# Altium schematic sheet WLAN_BLUETOOTH.SchDoc: WLAN_BLUETOOTH
size A4; Date: 21-MAR-2018; Author: A.B; CompanyName: STMicroelectronics; Organization: MCD/TOOLS/GNB; Address1: 12, Rue Jules HOROWITZ; Address2: 38019 Grenoble; Address3: FRANCE; DocumentNumber: MB1605; Revision: B-01; SheetNumber: 12; SheetTotal: 18; Project: STM32MP257
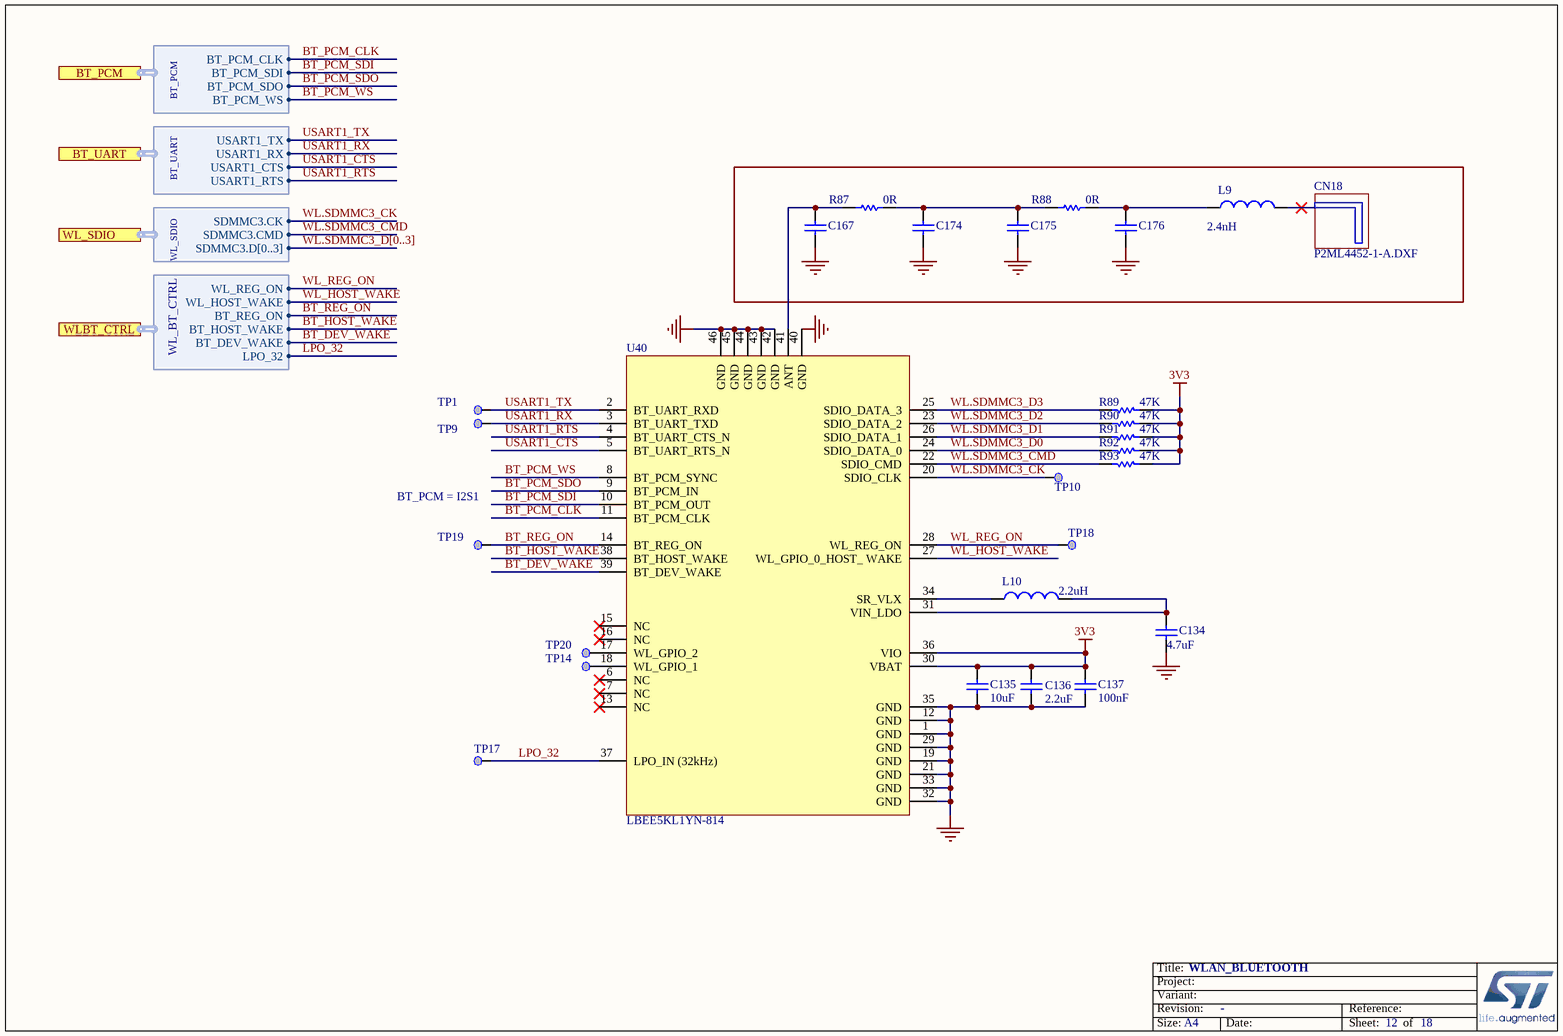
[diagram p0: WLAN_BLUETOOTH.SchDoc]

## Parts
C134  value 4.7uF  [C0402]  (hidden comment: Capacitor)
C135  value 10uF  [C0603]  (hidden comment: Capacitor)
C136  value 2.2uF  [C0603]  (hidden comment: Capacitor)
C137  value 100nF  [C0402]
C167  Capacitor  [C0402]  (value not drawn)
C174  Capacitor  [C0402]  (value not drawn)
C175  Capacitor  [C0402]  (value not drawn)
C176  Capacitor  [C0402]  (value not drawn)
CN18  value P2ML4452-1-A.DXF  [ANT_MURATA_TYPE-1-DX_P2ML4452-1-A_DXF]  (hidden comment: antenna_Wifi_BLE_Murata)  (no BOM)
L9  value 2.4nH  [IND_0402_MURATA_LQW15AN2N4C00X]  (hidden comment: Inductor)
L10  value 2.2uH  [L0603]  (hidden comment: Inductor)
R87  value 0R  [R0402]  (hidden comment: Resistor)
R88  value 0R  [R0402]  (hidden comment: Resistor)
R89  value 47K  [R0402]  (hidden comment: Resistor)
R90  value 47K  [R0402]  (hidden comment: Resistor)
R91  value 47K  [R0402]  (hidden comment: Resistor)
R92  value 47K  [R0402]  (hidden comment: Resistor)
R93  value 47K  [R0402]  (hidden comment: Resistor)
TP1  Test Point  [TP_SMD_0-6MM]  (value not drawn)  (no BOM)
TP9  Test Point  [TP_SMD_0-6MM]  (value not drawn)  (no BOM)
TP10  Test Point  [TP_SMD_0-6MM]  (value not drawn)  (no BOM)
TP14  Test Point  [TP_SMD_0-6MM]  (value not drawn)  (no BOM)
TP17  Test Point  [TP_SMD_0-6MM]  (value not drawn)  (no BOM)
TP18  Test Point  [TP_SMD_0-6MM]  (value not drawn)  (no BOM)
TP19  Test Point  [TP_SMD_0-6MM]  (value not drawn)  (no BOM)
TP20  Test Point  [TP_SMD_0-6MM]  (value not drawn)  (no BOM)
U40  LBEE5KL1YN-814  [MOD_WLAN-BT_MURATA_LBEE5KL1YN-814]

## Ports
BT_PCM (harness BT_PCM), BT_UART (harness BT_UART), WL_SDIO (harness WL_SDIO), WLBT_CTRL (harness WL_BT_CTRL)

## Harnesses
BT_PCM: BT_PCM_CLK, BT_PCM_SDI, BT_PCM_SDO, BT_PCM_WS
BT_UART: USART1_TX, USART1_RX, USART1_CTS, USART1_RTS
WL_SDIO: SDMMC3.CMD, SDMMC3.CK, SDMMC3.D[0..3]
WL_BT_CTRL: WL_REG_ON, WL_HOST_WAKE, BT_REG_ON, BT_HOST_WAKE, BT_DEV_WAKE, LPO_32

## Nets
3V3: C135.2 C136.2 C137.2 R89.1 R90.1 R91.1 R92.1 R93.1 U40.30(VBAT) U40.36(VIO)
GND: C134.1 C135.1 C136.1 C137.1 C167.1 C174.1 C175.1 C176.1 U40.1(GND) U40.12(GND) U40.19(GND) U40.21(GND) U40.29(GND) U40.32(GND) U40.33(GND) U40.35(GND) U40.40(GND) U40.42(GND) U40.43(GND) U40.44(GND) U40.45(GND) U40.46(GND)
BT_DEV_WAKE: U40.39(BT_DEV_WAKE) ; port WLBT_CTRL.BT_DEV_WAKE
BT_HOST_WAKE: U40.38(BT_HOST_WAKE) ; port WLBT_CTRL.BT_HOST_WAKE
BT_PCM_CLK: U40.11(BT_PCM_CLK) ; port BT_PCM.BT_PCM_CLK
BT_PCM_SDI: U40.10(BT_PCM_OUT) ; port BT_PCM.BT_PCM_SDI
BT_PCM_SDO: U40.9(BT_PCM_IN) ; port BT_PCM.BT_PCM_SDO
BT_PCM_WS: U40.8(BT_PCM_SYNC) ; port BT_PCM.BT_PCM_WS
BT_REG_ON: TP19.1 U40.14(BT_REG_ON) ; port WLBT_CTRL.BT_REG_ON
LPO_32: TP17.1 U40.37(LPO_IN_(32kHz)) ; port WLBT_CTRL.LPO_32
USART1_CTS: U40.5(BT_UART_RTS_N) ; port BT_UART.USART1_CTS
USART1_RTS: U40.4(BT_UART_CTS_N) ; port BT_UART.USART1_RTS
USART1_RX: TP9.1 U40.3(BT_UART_TXD) ; port BT_UART.USART1_RX
USART1_TX: TP1.1 U40.2(BT_UART_RXD) ; port BT_UART.USART1_TX
WL.SDMMC3_CK: TP10.1 U40.20(SDIO_CLK) ; port WL_SDIO.SDMMC3.CK
WL.SDMMC3_CMD: R93.2 U40.22(SDIO_CMD) ; port WL_SDIO.SDMMC3.CMD
WL.SDMMC3_D0: R92.2 U40.24(SDIO_DATA_0)
WL.SDMMC3_D1: R91.2 U40.26(SDIO_DATA_1)
WL.SDMMC3_D2: R90.2 U40.23(SDIO_DATA_2)
WL.SDMMC3_D3: R89.2 U40.25(SDIO_DATA_3)
WL_HOST_WAKE: U40.27(WL_GPIO_0_HOST__WAKE) ; port WLBT_CTRL.WL_HOST_WAKE
WL_REG_ON: TP18.1 U40.28(WL_REG_ON) ; port WLBT_CTRL.WL_REG_ON
NetC134_2: C134.2 L10.2 U40.31(VIN_LDO)
NetC167_2: C167.2 R87.2 U40.41(ANT)
NetC174_2: C174.2 C175.2 R87.1 R88.2
NetC176_2: C176.2 L9.1 R88.1
NetL10_1: L10.1 U40.34(SR_VLX)
NetTP14_1: TP14.1 U40.18(WL_GPIO_1)
NetTP20_1: TP20.1 U40.17(WL_GPIO_2)

Not connected (* = marked no-connect by the designer): L9 2*; U40 6(NC)* 7(NC)* 13(NC)* 15(NC)* 16(NC)*

## Buses and harness runs
bus WL.SDMMC3_D[0..3]

## Notes on the sheet
- (near TP19) BT_PCM = I2S1
- Title:
- Project:
- Size:
- Revision:
- Variant:
- A4
- -
- Date:
- Reference:
- Sheet:
- of

## Library data of the parts
C134 = MCD-01356: Capacitor, MLCC, 4.7uF, 6V3, X5R, 20%, 0402, T=0,5mm; Manufacturer_Part_Number: GRM155R60J475ME47; Manufacturer: MURATA; Alternate_Manufacturer_Part_Number: GRM155R60J475ME87; Part_Preference: Recommended; Provided_By: SUBCO; Order_Code_RS: 814-5230; ECCN_EU: NEC; ECCN_US: EAR99; Component_Country_Of_Origin: Japan; ID: 3456; ShowFields: YES; Internal_Part_Number: MCD-01356; ComponentLink1Description: Datasheet; Status: Released; Part_Type: Capacitor; Package: 0402; ComponentLink1URL: http://tunmcdsvn.tun.st.com/Component_Documentation_Library/Trunk/Capacitor/MURATA_GRM_Series; Alternate_Manufacturer: MURATA; Order_Code_Digikey: 490-5915-1-ND; Order_Code_Farnell: 2666407
C135 = MCD-00099: Capacitor, MLCC, 10uF, 10V, X5R, 10%, 0603, T=0,8mm; Manufacturer_Part_Number: GRM188R61A106KE69D; Manufacturer: MURATA; Part_Preference: Recommended; ECCN_US: EAR99; ECCN_EU: NEC; Provided_By: SUBCO; Initial_Board_Reference: MB1262; Order_Code_RS: 170-6168; Component_Country_Of_Origin: Japan; ID: 2770; ShowFields: YES; Internal_Part_Number: MCD-00099; Status: Released; Part_Type: Capacitor; Package: 0603; ComponentLink1Description: Datasheet; ComponentLink1URL: http://tunmcdsvn.tun.st.com/Component_Documentation_Library/Trunk/Capacitor/MURATA_GRM_Series; Order_Code_Digikey: 490-10474-1-ND; Order_Code_Farnell: 2494233
C136 = MCD-00012: Capacitor, MLCC, 2.2uF, 10V, X5R, 10%, 0603, T=0,8mm; Manufacturer_Part_Number: CC0603KRX5R6BB225; Manufacturer: YAGEO; Alternate_Manufacturer_Part_Number: C0603C225K8PACTU; Alternate_Manufacturer: KEMET; BMS_Part_Number: 9142010; Part_Preference: Recommended; ECCN_US: EAR99; ECCN_EU: NEC; Provided_By: SUBCO; Initial_Board_Reference: MB1274; Component_Country_Of_Origin: China; ID: 2467; ShowFields: YES; Internal_Part_Number: MCD-00012; ComponentLink1Description: Datasheet; Status: Released; Part_Type: Capacitor; Package: 0603; ComponentLink1URL: http://tunmcdsvn.tun.st.com/Component_Documentation_Library/Trunk/Capacitor/YAGEO_X5R_Series; Order_Code_Digikey: 311-1451-1-ND; Order_Code_Farnell: 2370679; Order_Code_RS: N/A
C137 = MCD-00006: Capacitor,100nF,16V,X7R,10%,0402; Manufacturer_Part_Number: CC0402KRX7R7BB104; Manufacturer: YAGEO; Alternate_Manufacturer: MURATA; Alternate_Manufacturer_Part_Number: GCM155R71C104KA55D; Part_Preference: Recommended; Partial_Alternate_Internal_Part_Number: MCD-03299; ECCN_US: EAR99; ECCN_EU: NEC; Provided_By: SUBCO; Initial_Board_Reference: MB1274; Order_Code_RS: 616-9701; Component_Country_Of_Origin: China; ID: 2474; ShowFields: YES; Alternate_EMS: M; Internal_Part_Number: MCD-00006; ComponentLink1Description: Datasheet; Status: Released; Part_Type: Capacitor; Package: 0402; ComponentLink1URL: http://tunmcdsvn.tun.st.com/Component_Documentation_Library/Trunk/Capacitor/YAGEO_X7R_Series; Order_Code_Digikey: 311-1338-1-ND; Order_Code_Farnell: 9402047
C167 C174-C176 = MCD-00200: Capacitor, MLCC, 12pF, 50V, NPO, 5%, 0402, T=0,5mm; Manufacturer_Part_Number: CC0402JRNPO9BN120; Manufacturer: YAGEO; Part_Preference: Recommended; Provided_By: SUBCO; ECCN_EU: NEC; ECCN_US: EAR99; Component_Country_Of_Origin: China; ID: 2667; ShowFields: YES; Internal_Part_Number: MCD-00200; Value: 12pF; Status: Checked; Part_Type: Capacitor; Package: 0402; ComponentLink1Description: Datasheet; ComponentLink1URL: http://tunmcdsvn.tun.st.com/Component_Documentation_Library/Trunk/Capacitor/YAGEO_NP0_Series; Alternate_Manufacturer: N/A; Alternate_Manufacturer_Part_Number: N/A; Order_Code_Digikey: 311-1016-1-ND; Order_Code_Farnell: 2370624; Order_Code_RS: N/A
CN18 = MCD-00656: Murata_Type1DX_AntennaDesign_P2ML4452-1-A.DXF; Part_Type: Misc; Manufacturer: MURATA; Part_Preference: Recommended; Initial_Board_Reference: MB1272; Component_Country_Of_Origin: Unknown; ID: 3086; ShowFields: YES; Internal_Part_Number: MCD-00656; Status: New; Manufacturer_Part_Number: Antenna design; ComponentLink1Description: Datasheet; ComponentLink1URL: http://tunmcdsvn.tun.st.com/Component_Datasheet_Library/Trunk/Misc/Murata_Type1DX_AntennaDesign_20160311; ECCN_US: n/a; ECCN_EU: n/a; Provided_By: n/a; Order_Code_Digikey: N/A; Order_Code_Farnell: N/A; Order_Code_RS: N/A; Package: N/A
L9 = MCD-00657: Inductor,2.4nH,+-0.2nH,0.05R,0.85A,0402; Manufacturer_Part_Number: LQW15AN2N4C00#; Manufacturer: MURATA; Part_Preference: Recommended; Provided_By: SUBCO; Initial_Board_Reference: MB1272; Order_Code_RS: 177-6240; Component_Country_Of_Origin: Japan; ID: 3088; ShowFields: YES; Internal_Part_Number: MCD-00657; Status: Checked; Part_Type: Inductor; Package: 0402; ComponentLink1Description: Datasheet; ComponentLink1URL: http://tunmcdsvn.tun.st.com/Component_Documentation_Library/Trunk/Inductor/MURATA_LQW15ANx_Series; ECCN_US: n/a; ECCN_EU: n/a; Order_Code_Digikey: N/A; Order_Code_Farnell: N/A
L10 = MCD-00659: Inductor, 2.2µH, 20%, Isat 0.35A, DCR 0.2Ohm, 0603; Manufacturer_Part_Number: LQM18PN2R2MGH; Manufacturer: MURATA; Part_Preference: Recommended; Provided_By: SUBCO; Initial_Board_Reference: MB1272; Component_Country_Of_Origin: Japan; ID: 3085; ShowFields: YES; Internal_Part_Number: MCD-00659; Status: Checked; Part_Type: Inductor; Package: 0603; ComponentLink1Description: Datasheet; ComponentLink1URL: http://tunmcdsvn.tun.st.com/Component_Documentation_Library/Trunk/Inductor/MURATA_LQM_Series; ECCN_US: n/a; ECCN_EU: n/a; Order_Code_Digikey: 490-14478-1-ND; Order_Code_Farnell: N/A; Order_Code_RS: N/A
R87 R88 = MCD-00052: Resistor,0R,0402,5%,1/16W; Manufacturer_Part_Number: RC0402JR-070RL; Manufacturer: YAGEO; Part_Preference: Recommended; ECCN_US: EAR99; ECCN_EU: NEC; Provided_By: SUBCO; Initial_Board_Reference: MB1274; Order_Code_RS: 618-5804; Component_Country_Of_Origin: China; ID: 2540; ShowFields: YES; Internal_Part_Number: MCD-00052; Status: Released; Part_Type: Resistor; Package: 0402; ComponentLink1Description: Datasheet; ComponentLink1URL: http://tunmcdsvn.tun.st.com/Component_Documentation_Library/Trunk/Resistor/YAGEO_RC_L_Series; Order_Code_Digikey: 311-0.0JRCT-ND; Order_Code_Farnell: 9232516RL
R89-R93 = MCD-00063: Resistor,47K,0402,1%,1/16W; Manufacturer_Part_Number: RC0402FR-0747KL; Manufacturer: YAGEO; Part_Preference: Recommended; ECCN_US: EAR99; ECCN_EU: NEC; Provided_By: SUBCO; Initial_Board_Reference: MB1274; Component_Country_Of_Origin: China; ID: 2528; ShowFields: YES; Internal_Part_Number: MCD-00063; ComponentLink1Description: Datasheet; Status: Released; Part_Type: Resistor; ComponentLink1URL: http://tunmcdsvn.tun.st.com/Component_Documentation_Library/Trunk/Resistor/YAGEO_RC_L_Series; Package: 0402; Order_Code_Digikey: 311-47.0KLRCT-ND; Order_Code_Farnell: 9239430; Order_Code_RS: N/A
TP1 TP9 TP10 TP14 TP17-TP20 = MCD-00631: Test Point 0.6mm; Part_Type: Misc; Part_Preference: Recommended; Initial_Board_Reference: MB1264; ID: 3108; ShowFields: YES; Internal_Part_Number: MCD-00631; Status: Released; ECCN_US: n/a; ECCN_EU: n/a; Provided_By: n/a; ComponentLink1Description: Datasheet; Manufacturer: N/A; Manufacturer_Part_Number: N/A; Order_Code_Digikey: N/A; Order_Code_Farnell: N/A; Order_Code_RS: N/A
U40 = MCD-03465: IC, IEEE802.11b/g/n W-LAN + Bluetooth 5.2(BR/EDR/BLE) module; Part_Preference: Recommended; Manufacturer: MURATA; Component_Country_Of_Origin: China°; ShowFields: YES; ID: 5581; Internal_Part_Number: MCD-03465; Value: LBEE5KL1YN-814; Status: New; Part_Type: IC; Manufacturer_Part_Number: LBEE5KL1YN-814; ComponentLink1URL: http://tunmcdsvn.tun.st.com/Component_Documentation_Library/Trunk/IC/MURATA_LBEE5KL1YN; Order_Code_Digikey: 490-LBEE5KL1YN-814TR-ND; Order_Code_Farnell: 4035662; Order_Code_RS: N/A